# Altium schematic sheet Motherboard_schematic.SchDoc
size A3; SheetNumber: 1; SheetTotal: 1
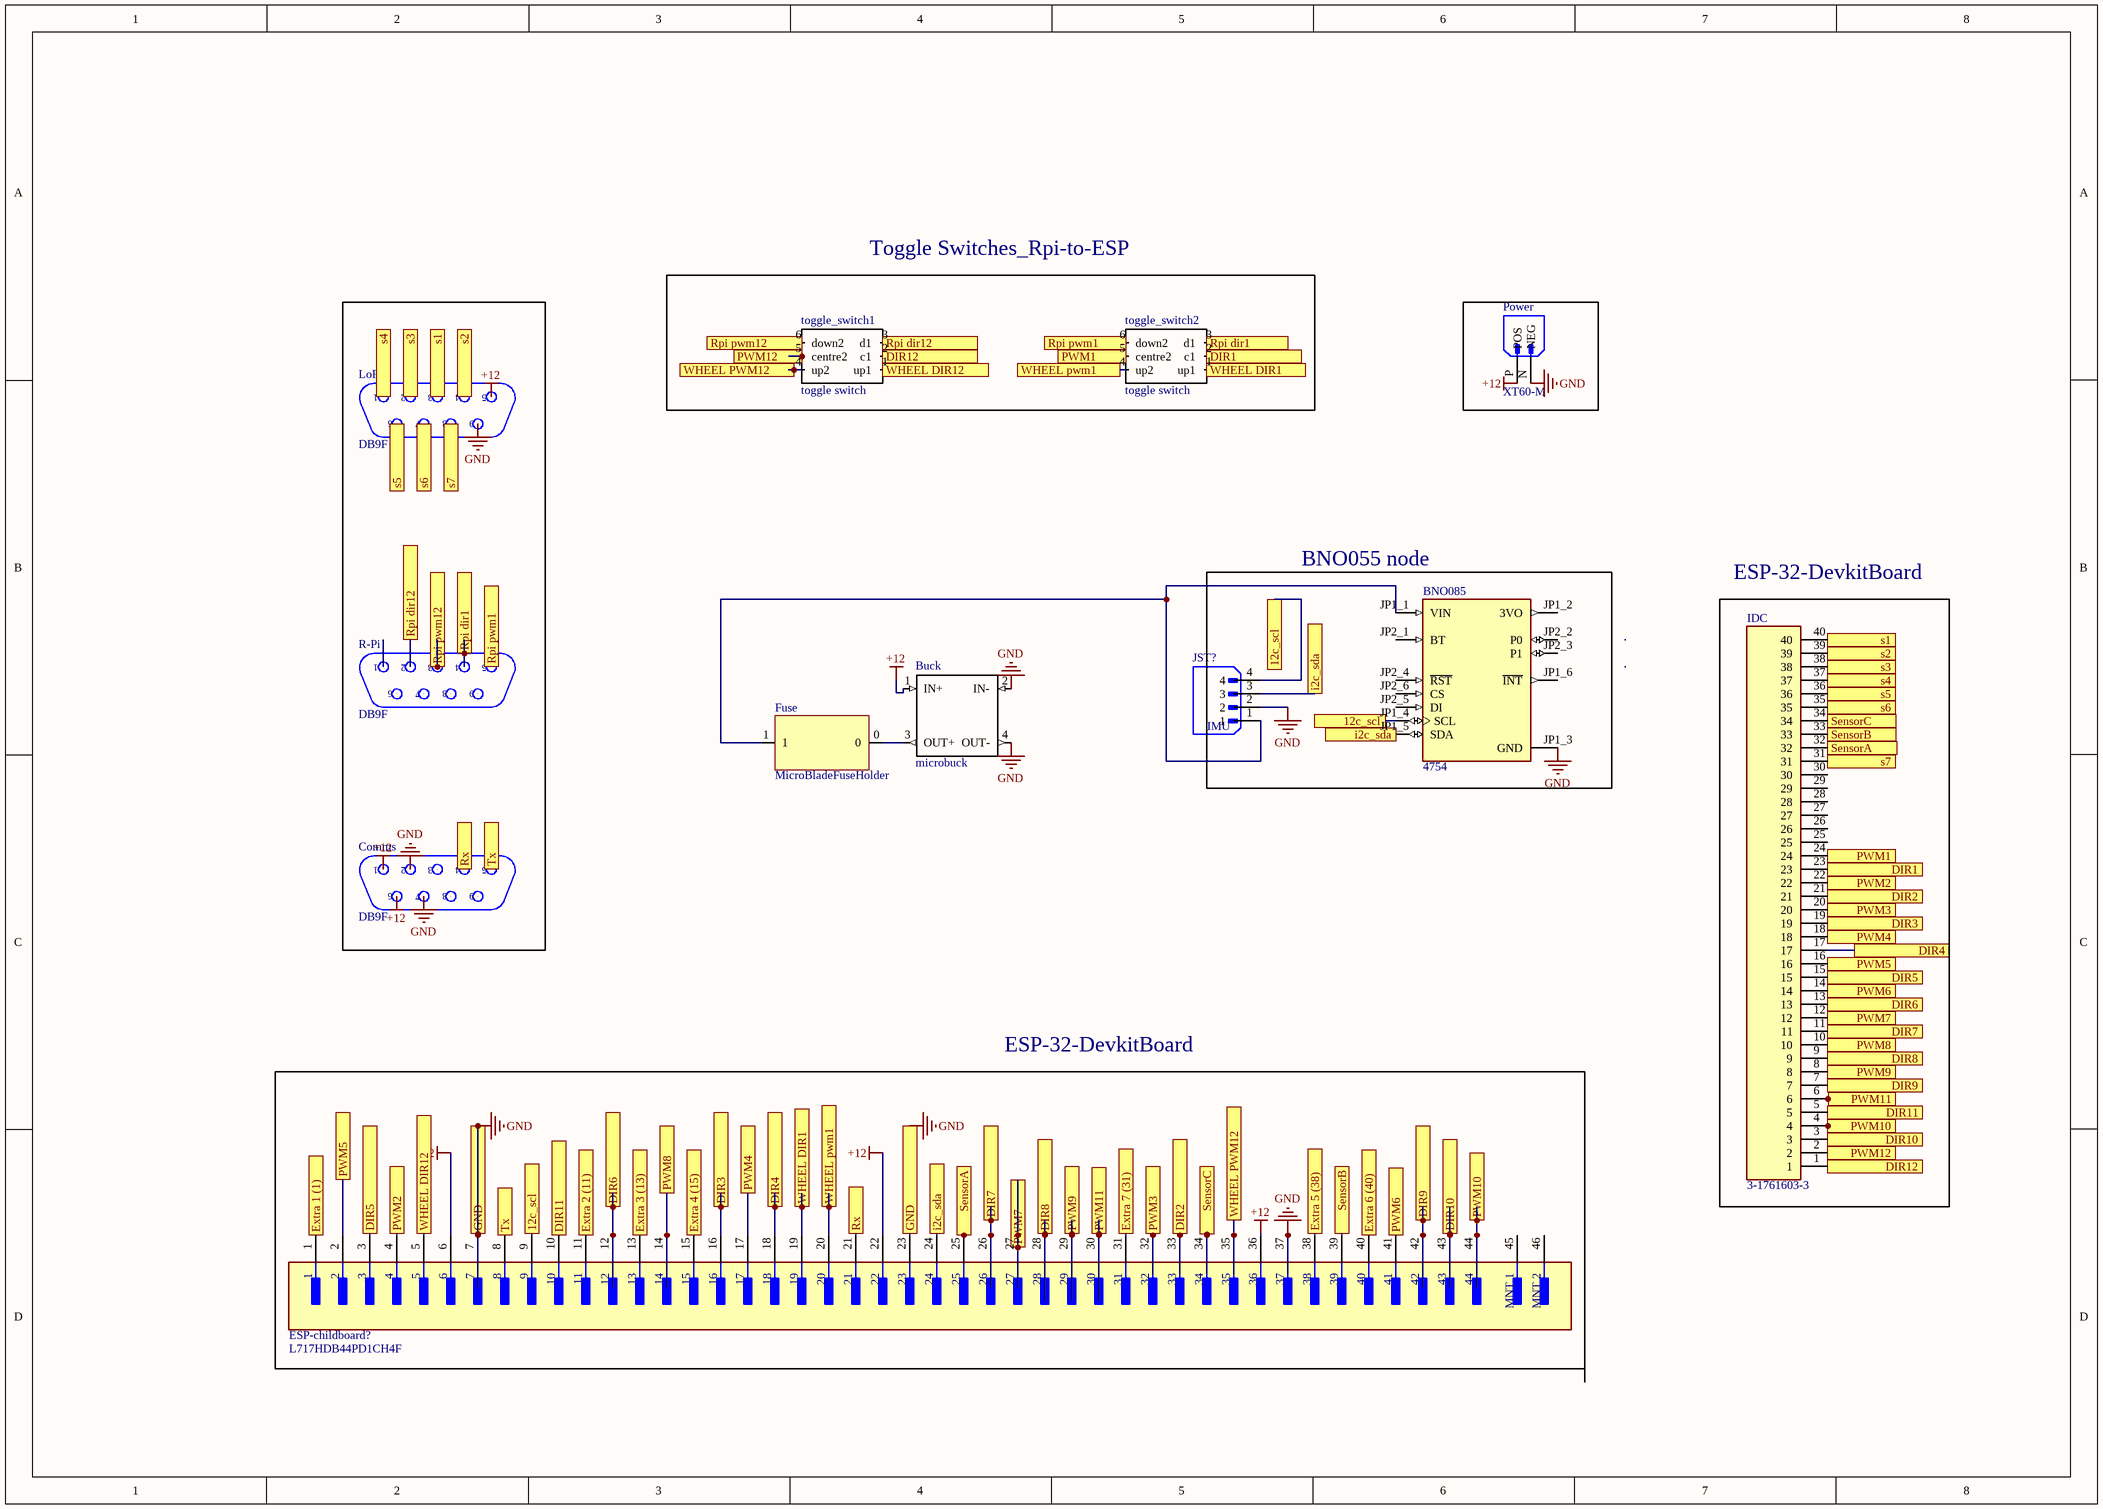
[diagram p0: Motherboard_schematic.SchDoc]

## Parts
BNO085  4754  [MODULE_4754]
Buck  microbuck  [Micro buck]
Comms  DB9F  [D-09F]
ESP-childboard?  L717HDB44PD1CH4F  [FP-L717HDB44PD1CH4F-MFG]
Fuse  MicroBladeFuseHolder
IDC  3-1761603-3  [TE_3-1761603-3]
JST?  IMU  [JST_B4B-EH-A]
LoRa  DB9F  [D-09F]
Power  XT60-M  [AMASS_XT60-M]
R-Pi  DB9F  [D-09F]
toggle_switch1  toggle switch  [toggle switch]
toggle_switch2  toggle switch  [toggle switch]

## Blocks framed on the sheet
Toggle Switches_Rpi-to-ESP: toggle_switch1 toggle_switch2
BNO055 node: BNO085 JST?
ESP-32-DevkitBoard: IDC

## Ports
12c_scl, DIR1, DIR2, DIR3, DIR4, DIR5, DIR6, DIR7, DIR8, DIR9, DIR10, DIR11, DIR12, Extra 1 (1), Extra 2 (11), Extra 3 (13), Extra 4 (15), Extra 5 (38), Extra 6 (40), Extra 7 (31), GND, i2c_sda, PWM1, PWM2, PWM3, PWM4, PWM5, PWM6, PWM7, PWM8, PWM9, PWM10, PWM11, PWM12, Rpi dir1, Rpi dir12, Rpi pwm1, Rpi pwm12, Rx, s1, s2, s3, s4, s5, s6, s7, SensorA, SensorB, SensorC, Tx, WHEEL DIR1, WHEEL DIR12, WHEEL pwm1, WHEEL PWM12

## Nets
+12: Buck.1(IN+) Comms.1 Comms.6 ESP-childboard?.6 ESP-childboard?.22 ESP-childboard?.36 LoRa.5 Power.P(POS)
GND: BNO085.JP1_3(GND) Buck.2(IN-) Buck.4(OUT-) Comms.2 Comms.7 ESP-childboard?.7 ESP-childboard?.23 ESP-childboard?.37 JST?.2 LoRa.9 Power.N(NEG) ; port GND
12c_scl: BNO085.JP1_4(SCL) ESP-childboard?.9 JST?.4 ; port 12c_scl
DIR1: IDC.23 toggle_switch2.2(c1) ; port DIR1
DIR2: ESP-childboard?.33 IDC.21 ; port DIR2
DIR3: ESP-childboard?.16 IDC.19 ; port DIR3
DIR4: ESP-childboard?.18 IDC.17 ; port DIR4
DIR5: ESP-childboard?.3 IDC.15 ; port DIR5
DIR6: ESP-childboard?.12 IDC.13 ; port DIR6
DIR7: ESP-childboard?.26 IDC.11 ; port DIR7
DIR8: ESP-childboard?.28 IDC.9 ; port DIR8
DIR9: ESP-childboard?.42 IDC.7 ; port DIR9
DIR10: ESP-childboard?.43 IDC.3 ; port DIR10
DIR11: ESP-childboard?.10 IDC.5 ; port DIR11
DIR12: IDC.1 toggle_switch1.2(c1) ; port DIR12
Extra 1 (1): ESP-childboard?.1 ; port Extra 1 (1)
Extra 2 (11): ESP-childboard?.11 ; port Extra 2 (11)
Extra 3 (13): ESP-childboard?.13 ; port Extra 3 (13)
Extra 4 (15): ESP-childboard?.15 ; port Extra 4 (15)
Extra 5 (38): ESP-childboard?.38 ; port Extra 5 (38)
Extra 6 (40): ESP-childboard?.40 ; port Extra 6 (40)
Extra 7 (31): ESP-childboard?.31 ; port Extra 7 (31)
i2c_sda: BNO085.JP1_5(SDA) ESP-childboard?.24 JST?.3 ; port i2c_sda
PWM1: IDC.24 toggle_switch2.5(centre2) ; port PWM1
PWM2: ESP-childboard?.4 IDC.22 ; port PWM2
PWM3: ESP-childboard?.32 IDC.20 ; port PWM3
PWM4: ESP-childboard?.17 IDC.18 ; port PWM4
PWM5: ESP-childboard?.2 IDC.16 ; port PWM5
PWM6: ESP-childboard?.41 IDC.14 ; port PWM6
PWM7: ESP-childboard?.27 IDC.12 ; port PWM7
PWM8: ESP-childboard?.14 IDC.10 ; port PWM8
PWM9: ESP-childboard?.29 IDC.8 ; port PWM9
PWM10: ESP-childboard?.44 IDC.4 ; port PWM10
PWM11: ESP-childboard?.30 IDC.6 ; port PWM11
PWM12: IDC.2 toggle_switch1.5(centre2) ; port PWM12
Rpi dir1: R-Pi.4 toggle_switch2.3(d1) ; port Rpi dir1
Rpi dir12: R-Pi.2 toggle_switch1.3(d1) ; port Rpi dir12
Rpi pwm1: R-Pi.5 toggle_switch2.6(down2) ; port Rpi pwm1
Rpi pwm12: R-Pi.3 toggle_switch1.6(down2) ; port Rpi pwm12
Rx: Comms.4 ESP-childboard?.21 ; port Rx
s1: IDC.40 LoRa.3 ; port s1
s2: IDC.39 LoRa.4 ; port s2
s3: IDC.38 LoRa.2 ; port s3
s4: IDC.37 LoRa.1 ; port s4
s5: IDC.36 LoRa.6 ; port s5
s6: IDC.35 LoRa.7 ; port s6
s7: IDC.31 LoRa.8 ; port s7
SensorA: ESP-childboard?.25 IDC.32 ; port SensorA
SensorB: ESP-childboard?.39 IDC.33 ; port SensorB
SensorC: ESP-childboard?.34 IDC.34 ; port SensorC
Tx: Comms.5 ESP-childboard?.8 ; port Tx
WHEEL DIR1: ESP-childboard?.19 toggle_switch2.1(up1) ; port WHEEL DIR1
WHEEL DIR12: ESP-childboard?.5 toggle_switch1.1(up1) ; port WHEEL DIR12
WHEEL pwm1: ESP-childboard?.20 toggle_switch2.4(up2) ; port WHEEL pwm1
WHEEL PWM12: ESP-childboard?.35 toggle_switch1.4(up2) ; port WHEEL PWM12
NetBNO085_JP1_1: BNO085.JP1_1(VIN) Fuse.1 JST?.1
NetBuck_3: Buck.3(OUT+) Fuse.0

Not connected (* = marked no-connect by the designer): BNO085 JP1_2(3VO) JP1_6(~{INT}) JP2_1(BT) JP2_2(P0) JP2_3(P1) JP2_4(~{RST}) JP2_5(DI) JP2_6(CS); Comms 3 8 9; ESP-childboard? 45(MNT_1) 46(MNT_2); IDC 25 26 27 28 29 30; R-Pi 1 6 7 8 9

## Notes on the sheet
- ESP-32-DevkitBoard

## Library data of the parts
BNO085 = 4754: Adafruit 9-DOF Orientation IMU Fusion Breakout - BNO085 (BNO080) - STEMMA QT / Qwiic; MP: 4754; SnapEDA_Link: https://www.snapeda.com/parts/4754/Adafruit+Industries/view-part/?ref=snap; Price: None; Purchase-URL: https://pricing.snapeda.com/search/part/4754/?ref=eda; MF: Adafruit; Package: None; Availability: In Stock; Check_prices: https://www.snapeda.com/parts/4754/Adafruit+Industries/view-part/?ref=eda; Value: *
Comms LoRa R-Pi = DB9F: Adapter Connector D-Sub, 9 Pin Female To Modular, Female Jack, 8p8c _RJ45_ Beige; MF: Assmann WSW; SnapEDA_Link: https://www.snapeda.com/parts/DB9F/Assmann%20WSW%20Components/view-part/558712/?ref=snap; MP: DB9F; Availability: Unavailable; Price: None; Value: *; Package: None
ESP-childboard? = CMP-02362-000001-1: CONN DSUB HD PLUG 44POS R/A SLDR; Current Rating: 3A; Body Material: Steel; Number of Contacts: 44; Connector Type: D-Sub; Number of Ports: 1; Gender: Male; Voltage Rating: 250V; Width: 12.55mm; Contact Plating: Gold; Max Operating Temperature: 105°C; Number of Terminals: 44; Length: 53.09mm; Number of Rows: 3; Number of Positions: 44; Min Operating Temperature: -55°C; Orientation: Right Angle; Packaging: Tray; Package Quantity: 50; Termination: Solder; Depth: 22.22mm; Housing Material: Thermoplastic; Mount: Through Hole; Contact Material: Brass
IDC = 3-1761603-3: AMP-LATCH 40 Position 2.54 mm Dual Row Through-Hole Straight Pin Header; Centerline_Pitch: 2.54 mm[.1 in]; Number_of_Positions: 40; MF: TE Connectivity; Product_Type: Connector; MP: 3-1761603-3; SnapEDA_Link: https://www.snapeda.com/parts/3-1761603-3/TE%20Connectivity%20AMP%20Connectors/view-part/379325/?ref=snap; Value: *; Package: None; DigiKey-Purchase-URL: https://snapeda.com/shop?store=DigiKey&id=379325; Price: None; EU_RoHS_Compliance: Compliant; Availability: Unavailable
JST? = B4B-EH-A: Connector Header Through Hole 4 position 0.098 (2.50mm); MF: JST; SnapEDA_Link: https://www.snapeda.com/parts/B4B-EH-A/JST/view-part/?ref=snap; Package: None; Value: *; MP: B4B-EH-A; Check_prices: https://www.snapeda.com/parts/B4B-EH-A/JST/view-part/?ref=eda
Power = XT60-M: Plug; DC supply; XT60; male; PIN: 2; for cable; soldered; 30A; 500V; MF: AMASS; SnapEDA_Link: https://www.snapeda.com/parts/XT60-M/AMASS/view-part/?ref=snap; Package: Package; Value: *; MP: XT60-M; Check_prices: https://www.snapeda.com/parts/XT60-M/AMASS/view-part/?ref=eda